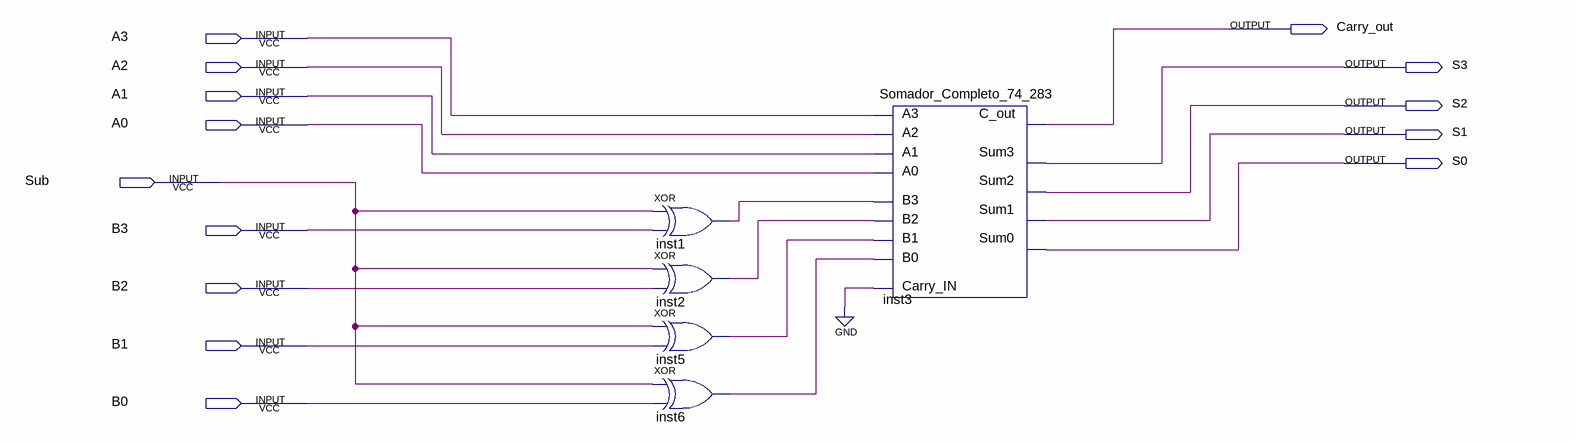
[diagram p0: schematic sheet]
// Quartus schematic TesteSomadorSubtrator4bits.bdf as structural Verilog: 5 symbols, 14 pins
module TesteSomadorSubtrator4bits (
  input  A3,
  input  A2,
  input  A1,
  input  A0,
  input  Sub,
  input  B3,
  input  B2,
  input  B1,
  input  B0,
  output Carry_out,
  output S3,
  output S2,
  output S1,
  output S0
);

  wire inst1_out, inst2_out, inst5_out, inst6_out;

  xor inst1 (inst1_out, Sub, B3);
  xor inst2 (inst2_out, Sub, B2);
  xor inst5 (inst5_out, Sub, B1);
  xor inst6 (inst6_out, Sub, B0);
  Somador_Completo_74_283 inst3 (
    .B3(inst1_out), .A3(A3), .B2(inst2_out), .A2(A2), .B1(inst5_out), .A1(A1), .B0(inst6_out), .A0(A0),
    .Carry_IN(1'b0), .C_out(Carry_out), .Sum3(S3), .Sum2(S2), .Sum0(S0), .Sum1(S1));
endmodule
